# Altium schematic sheet DAC Channel 12.SchDoc
size A3
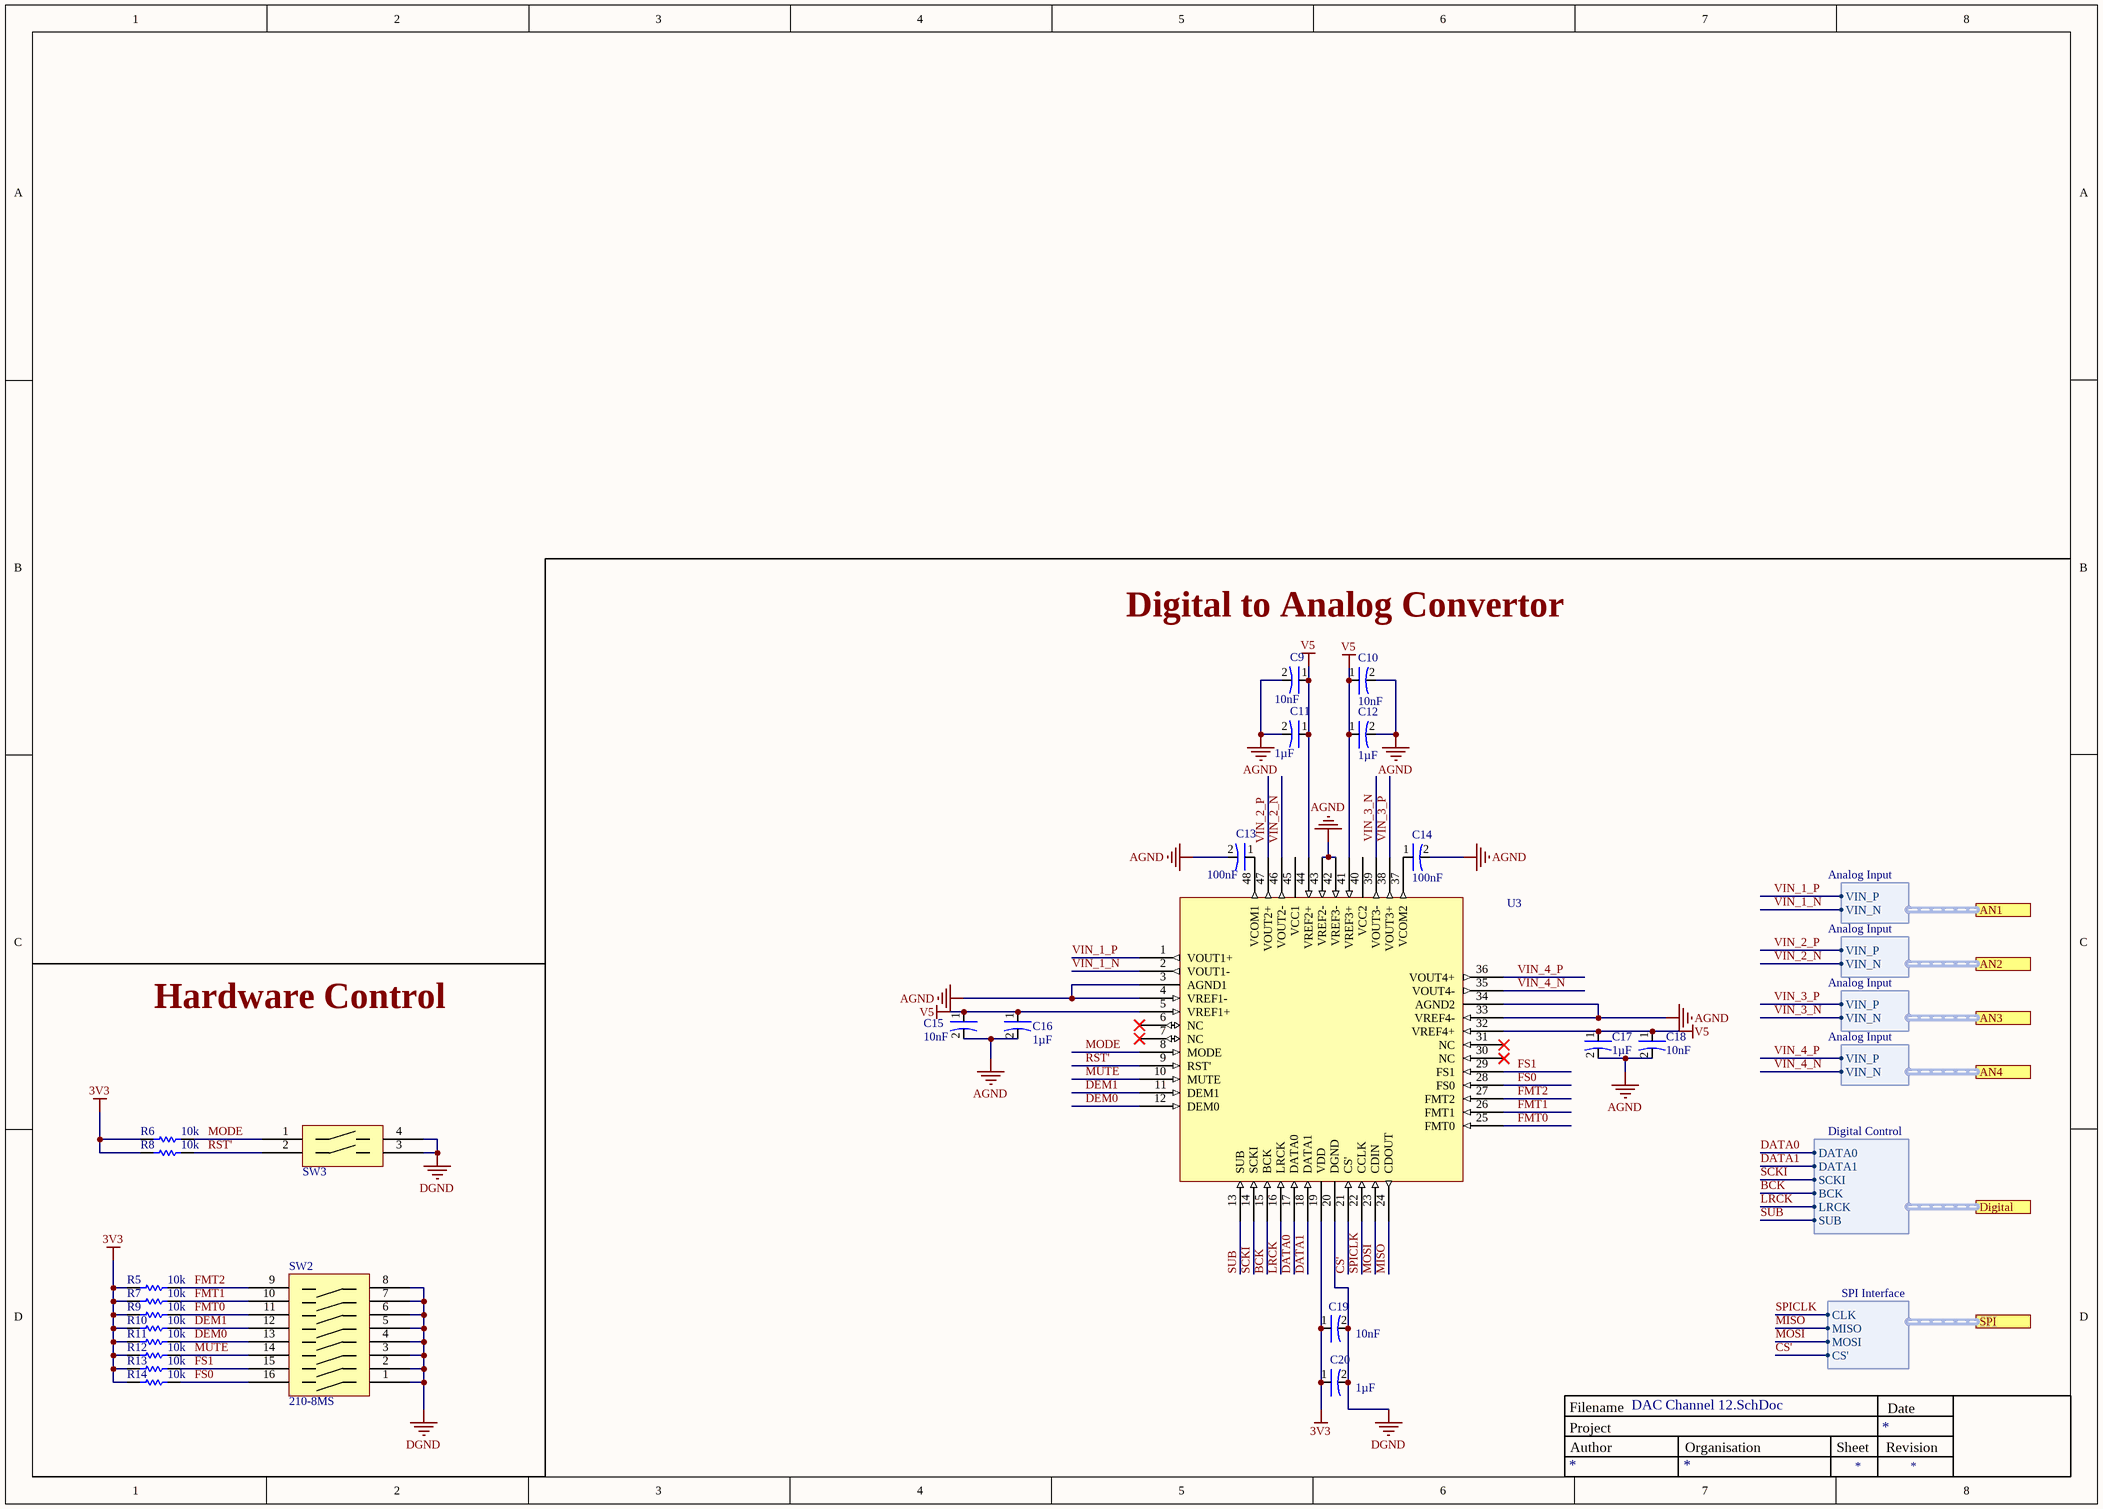
[diagram p0: DAC Channel 12.SchDoc]

## Parts
C9  value 10nF  [0805-M]  (hidden comment: CAP 10nF CER 0805 50V X7R 10%)
C10  value 10nF  [0805-M]  (hidden comment: CAP 10nF CER 0805 50V X7R 10%)
C11  value 1µF  [0805-L]  (hidden comment: CAP 1uF CER 0805 50V X7R 10%)
C12  value 1µF  [0805-L]  (hidden comment: CAP 1uF CER 0805 50V X7R 10%)
C13  value 100nF  [0603-M]  (hidden comment: CAP 100nF CER 0603 50V X7R 5%)
C14  value 100nF  [0603-M]  (hidden comment: CAP 100nF CER 0603 50V X7R 5%)
C15  value 10nF  [0805-M]  (hidden comment: CAP 10nF CER 0805 50V X7R 10%)
C16  value 1µF  [0805-L]  (hidden comment: CAP 1uF CER 0805 50V X7R 10%)
C17  value 1µF  [0805-L]  (hidden comment: CAP 1uF CER 0805 50V X7R 10%)
C18  value 10nF  [0805-M]  (hidden comment: CAP 10nF CER 0805 50V X7R 10%)
C19  value 10nF  [0805-M]  (hidden comment: CAP 10nF CER 0805 50V X7R 10%)
C20  value 1µF  [0805-L]  (hidden comment: CAP 1uF CER 0805 50V X7R 10%)
R5  value 10k  [0805-M]  (hidden comment: RES 10k 0805 125mW 1%)
R6  value 10k  [0805-M]  (hidden comment: RES 10k 0805 125mW 1%)
R7  value 10k  [0805-M]  (hidden comment: RES 10k 0805 125mW 1%)
R8  value 10k  [0805-M]  (hidden comment: RES 10k 0805 125mW 1%)
R9  value 10k  [0805-M]  (hidden comment: RES 10k 0805 125mW 1%)
R10  value 10k  [0805-M]  (hidden comment: RES 10k 0805 125mW 1%)
R11  value 10k  [0805-M]  (hidden comment: RES 10k 0805 125mW 1%)
R12  value 10k  [0805-M]  (hidden comment: RES 10k 0805 125mW 1%)
R13  value 10k  [0805-M]  (hidden comment: RES 10k 0805 125mW 1%)
R14  value 10k  [0805-M]  (hidden comment: RES 10k 0805 125mW 1%)
SW2  210-8MS  [210-8MS]
SW3  210-2MS  [210-2MS-Footprint-1]  (value not drawn)
U3  PCM4104PFBR  [CQFP50P1170X1170X100-48N]  (value not drawn)

## Ports
AN1 (harness Analog Input), AN2 (harness Analog Input), AN3 (harness Analog Input), AN4 (harness Analog Input), Digital (harness Digital Control), SPI (harness SPI Interface)

## Harnesses
SPI Interface: CLK, MISO, MOSI, CS'
Analog Input: VIN_P, VIN_N
Digital Control: DATA0, DATA1, SCKI, BCK, LRCK, SUB

## Nets
3V3: C19.1(Anode) C20.1(Anode) R5.2 R6.2 R7.2 R8.2 R9.2 R10.2 R11.2 R12.2 R13.2 R14.2 U3.19(VDD)
AGND: C9.2(Cathode) C10.2(Cathode) C11.2(Cathode) C12.2(Cathode) C13.2(Cathode) C14.2(Cathode) C15.2(Cathode) C16.2(Cathode) C17.2(Cathode) C18.2(Cathode) U3.3(AGND1) U3.4(VREF1-) U3.33(VREF4-) U3.34(AGND2) U3.42(VREF3-) U3.43(VREF2-)
DGND: C19.2(Cathode) C20.2(Cathode) SW2.1(SW1) SW2.2(SW2) SW2.3(SW3) SW2.4(SW4) SW2.5(SW1) SW2.6(SW2) SW2.7 SW2.8(SW4) SW3.3 SW3.4 U3.20(DGND)
V5: C9.1(Anode) C10.1(Anode) C11.1(Anode) C12.1(Anode) C15.1(Anode) C16.1(Anode) C17.1(Anode) C18.1(Anode) U3.5(VREF1+) U3.32(VREF4+) U3.41(VREF3+) U3.44(VREF2+)
BCK: U3.15(BCK) ; port Digital.BCK
CS': U3.21(CS') ; port SPI.CS'
DATA0: U3.17(DATA0) ; port Digital.DATA0
DATA1: U3.18(DATA1) ; port Digital.DATA1
DEM0: R11.1 SW2.13(SW4.in) U3.12(DEM0)
DEM1: R10.1 SW2.12(SW1.in) U3.11(DEM1)
FMT0: R9.1 SW2.11(SW2.in) U3.25(FMT0)
FMT1: R7.1 SW2.10(SW3.in) U3.26(FMT1)
FMT2: R5.1 SW2.9(SW4.in) U3.27(FMT2)
FS0: R14.1 SW2.16(SW1) U3.28(FS0)
FS1: R13.1 SW2.15(SW2.in) U3.29(FS1)
LRCK: U3.16(LRCK) ; port Digital.LRCK
MISO: U3.24(CDOUT) ; port SPI.MISO
MODE: R6.1 SW3.1 U3.8(MODE)
MOSI: U3.23(CDIN) ; port SPI.MOSI
MUTE: R12.1 SW2.14(SW3.in) U3.10(MUTE)
RST': R8.1 SW3.2 U3.9(RST')
SCKI: U3.14(SCKI) ; port Digital.SCKI
SPICLK: U3.22(CCLK) ; port SPI.CLK
SUB: U3.13(SUB) ; port Digital.SUB
VIN_1_N: U3.2(VOUT1-) ; port AN1.VIN_N
VIN_1_P: U3.1(VOUT1+) ; port AN1.VIN_P
VIN_2_N: U3.46(VOUT2-) ; port AN2.VIN_N
VIN_2_P: U3.47(VOUT2+) ; port AN2.VIN_P
VIN_3_N: U3.39(VOUT3-) ; port AN3.VIN_N
VIN_3_P: U3.38(VOUT3+) ; port AN3.VIN_P
VIN_4_N: U3.35(VOUT4-) ; port AN4.VIN_N
VIN_4_P: U3.36(VOUT4+) ; port AN4.VIN_P
NetC13_1: C13.1(Anode) U3.48(VCOM1)
NetC14_1: C14.1(Anode) U3.37(VCOM2)

Not connected (* = marked no-connect by the designer): U3 6(NC)* 7(NC)* 30(NC)* 31(NC)* 40(VCC2) 45(VCC1)

## Notes on the sheet
- Digital to Analog Convertor
- Hardware Control
- Project
- Filename
- Author
- Organisation
- Sheet
- Revision
- Date
  Date

## Library data of the parts
C9 C10 C15 C18 C19 = CAP 10nF CER 0805 50V X7R 10%-2: CAP-10nF-CER-0805-50V-X7R-10%; Manufacturer: Generic; Type: SMD; Bin: F1-C8-4; Design Item ID: CAP 10nF CER 0805 50V X7R 10%; Supplier 1: Mouser; Case/Package: 0805; Supplier Part Number 1: 81-GRM40X103K50D; Source: Capacitor Library.SchLib
C11 C12 C16 C17 C20 = CAP 1uF CER 0805 50V X7R 10%-2: CAP-1uF-CER-0805-50V-X7R-10%; Manufacturer: Generic; Type: SMD; Bin: F1-C1-05; Supplier Part Number 1: 963-UMK212B7105KG-T; Supplier 1: Mouser; Case/Package: 0805; Source: Capacitor Library.SchLib; Design Item ID: CAP 1uF CER 0805 50V X7R 10%; Status: Active
C13 C14 = CAP 100nF CER 0603 50V X7R 5%-2: CAP-100nF-CER-0603-50V-X7R-5%; Manufacturer: Generic; Type: SMD; Bin: F1-CM2-1; Supplier 1: Mouser; Case/Package: 0603; Source: Capacitor Library.SchLib; Status: Active; Supplier Part Number 1: 581-06035C104JAT2A; Design Item ID: CAP 100nF CER 0603 50V X7R 5%
R5-R14 = RES 10k 0805 125mW 1%-1: RES-10k-0805-125mW-1%; Manufacturer: Generic; MAPPING: 1(2,1,10k); Bin: F1-R12-10; Design Item ID: RES 10k 0805 125mW 1%; Case/Package: 0805; Type: SMD; Status: Active; Source: Resistor Library.SchLib
SW2 = 210-8MS-2: SWITCH DIP SMD SPST 8 100mA 50V; Manufacturer: C&K Components; Supplier Part Number 1: 774-2108MS; Design Item ID: 210-8MS; Source: Switches Library.SchLib; Case/Package: 16 PDIP; Supplier 1: Mouser; Status: Active; Type: TH
SW3 = CMP-01293-3: SWITCH DIP SPST 2 100mA 50V; Actuator Type: Slide (Standard); Electrical Life: 1000Cycles; Number of Positions: 2; Washable: No; Pitch: 0.1inch; Voltage Rating (DC): 20V; Terminal Pitch: 2.54mm; Contact Material: Copper; Length: 0.258inch; Termination: PC Pin; Lead Free: Lead Free; Max Current Rating: 100mA; Throw Configuration: SPST; Packaging: Rail/Tube; Current Rating: 100mA; Orientation: Straight; Min Operating Temperature: -40°C; Contact Plating: Gold,Tin; Max Operating Temperature: 85°C; Package Quantity: 85; Mount: Through Hole
U3 = CMP-019-00003-1: Converters - Digital to Analog (DAC) High-End 24-Bit 192kHz, 4-Ch D-S DAC; Resolution: 24b; Number of Bits: 24; Sampling Rate: 216000S/s; Supply Type: Analog,Digital; Min Supply Voltage: 4.75V; Power Consumption: 200mW; Number of Channels: 4; Max Power Dissipation: 286mW; Operating Supply Voltage: 5V; Polarity: Bipolar; Output Type: Voltage; Nominal Supply Current: 32mA; Number of Analog Inputs: 0; Interface: Serial,SPI; Conversion Rate: 216KS/s; Max Supply Voltage: 5.25V; Signal to Noise Ratio (SNR): 118dB; REACH SVHC: No SVHC; Case/Package: TQFP; Weight: 0.004938oz; Mount: Surface Mount; Number of Converters: 4; Radiation Hardening: No; Number of Pins: 48; Contact Plating: Gold; Number of Analog Outputs: 4; Lead Free: Lead Free; Packaging: Tape and Reel; Min Operating Temperature: -10°C; Number of DAC Channels: 4; Package Quantity: 2000; Max Operating Temperature: 70°C